# Altium schematic sheet Pixracer_V1_FMU_Alternative_3.SchDoc
size 371 x 257 mm; Origin: Eagle
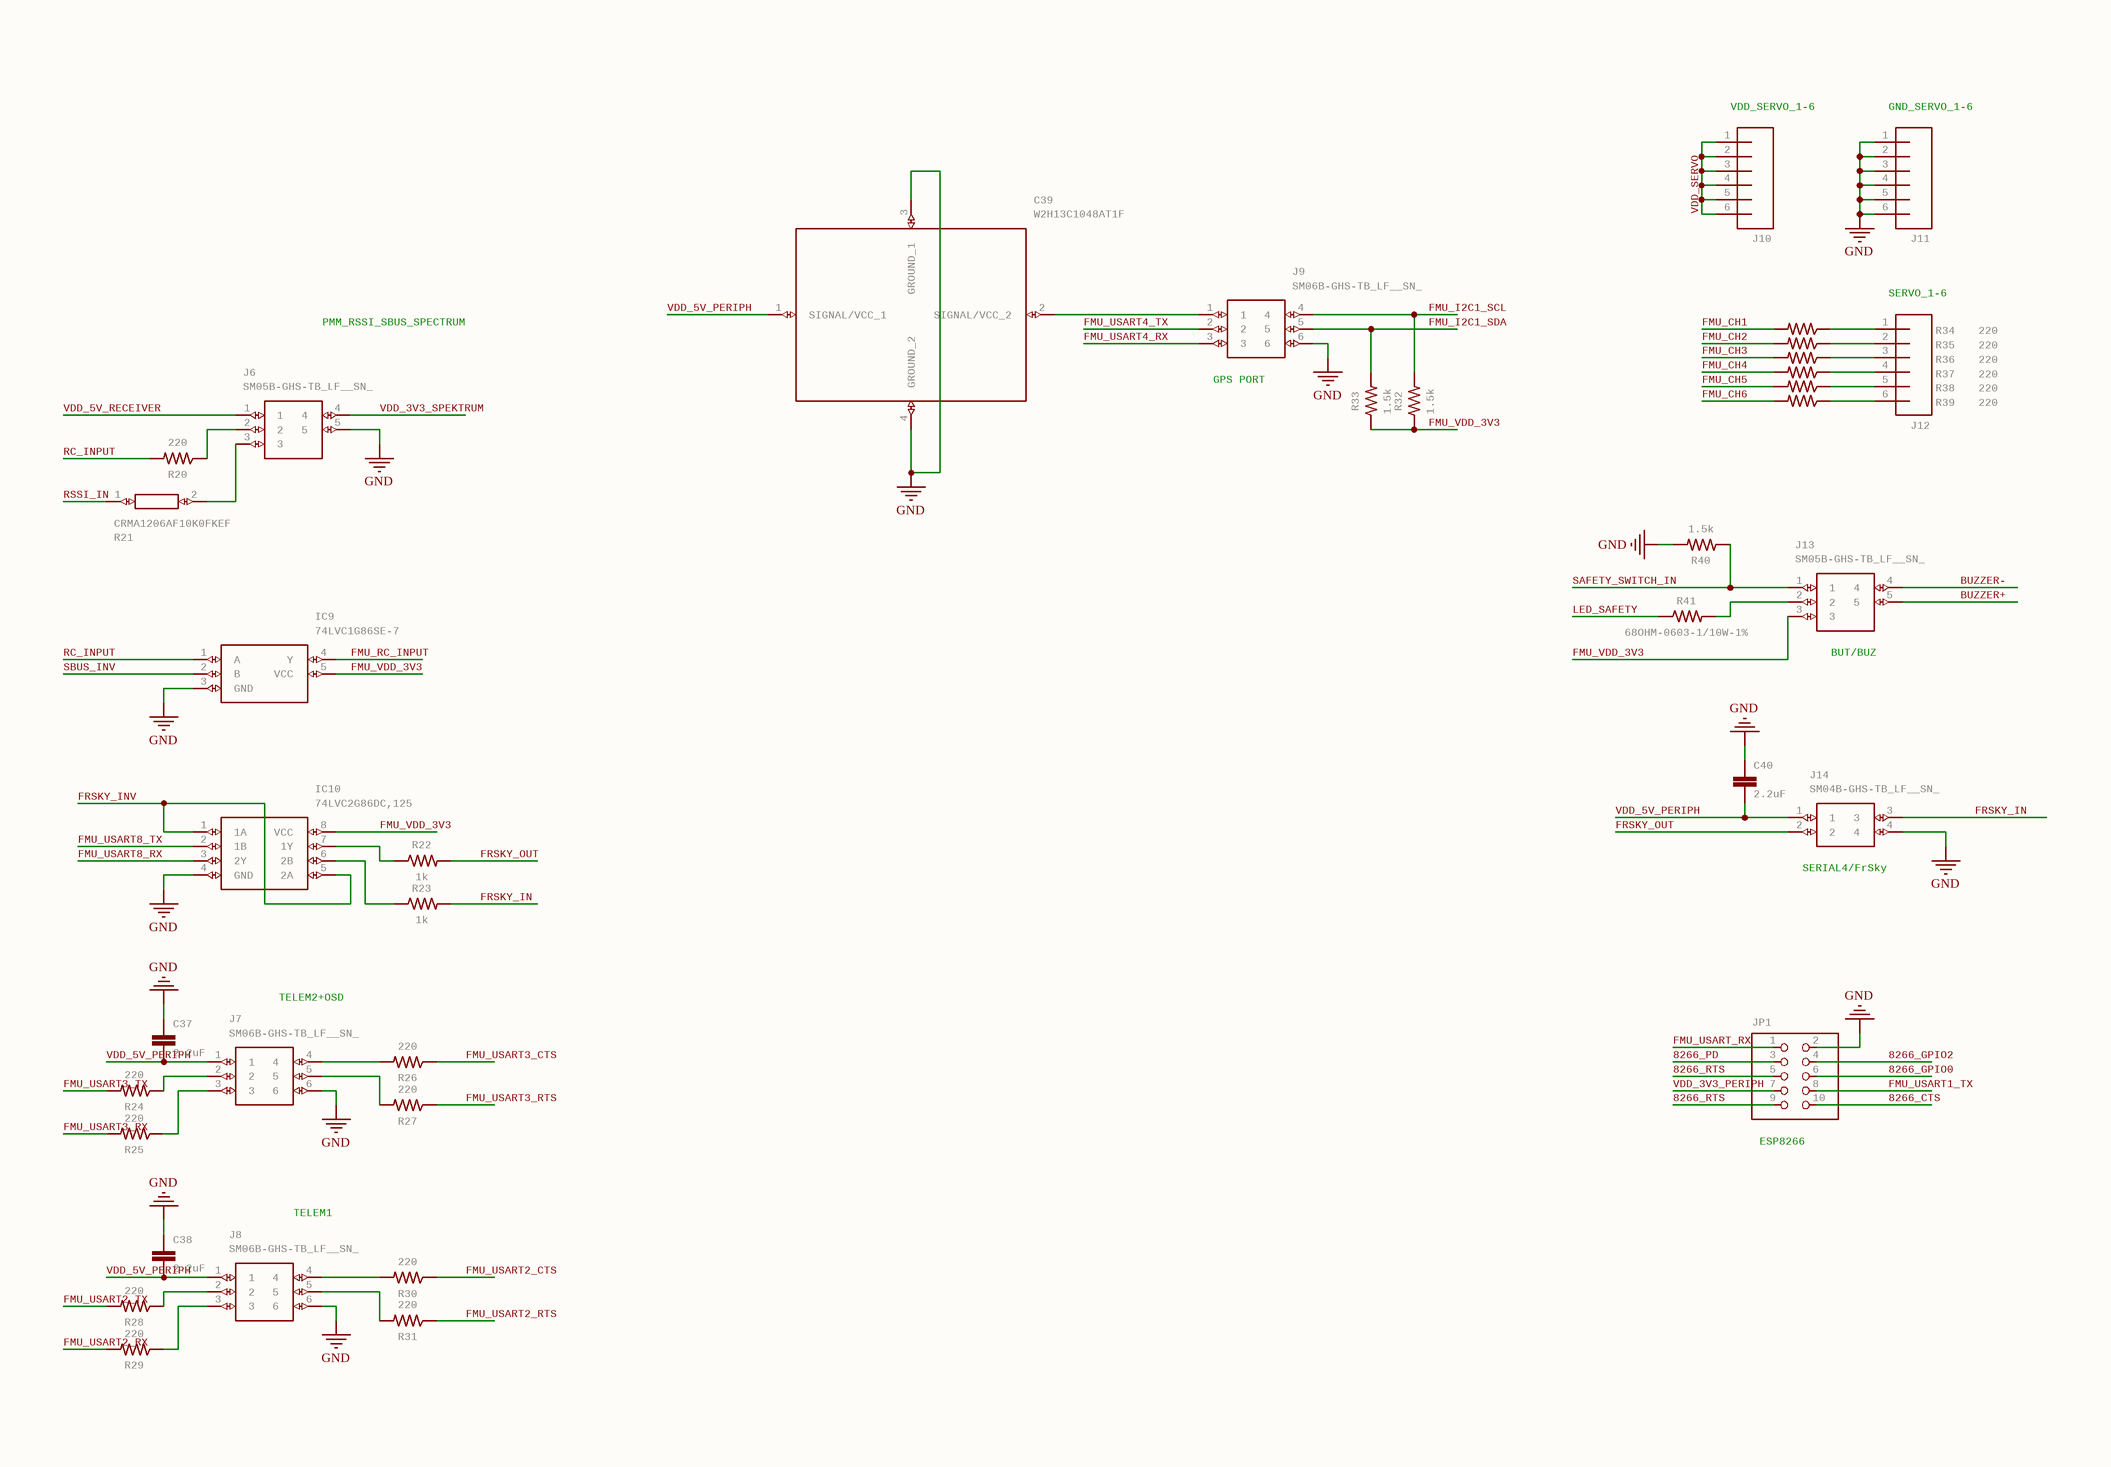
[diagram p0: Pixracer_V1_FMU_Alternative_3.SchDoc]

## Parts
C37  2.2uF  [1206]
C38  2.2uF  [1206]
C39  W2H13C1048AT1F  [W2H13C1048AT1A]
C40  2.2uF  [1206]
IC9  74LVC1G86SE-7  [SOT65P210X110-5N]
IC10  74LVC2G86DC,125  [SOP50P310X100-8N]
J6  SM05B-GHS-TB_LF__SN_  [SM05B-GHS-TB]
J7  SM06B-GHS-TB_LF__SN_  [SM06B-GHS-TB]
J8  SM06B-GHS-TB_LF__SN_  [SM06B-GHS-TB]
J9  SM06B-GHS-TB_LF__SN_  [SM06B-GHS-TB]
J10  CONN_06NO_SILK_NO_POP  [1X06_NO_SILK]  (value not drawn)
J11  CONN_06NO_SILK_NO_POP  [1X06_NO_SILK]  (value not drawn)
J12  CONN_06NO_SILK_NO_POP  [1X06_NO_SILK]  (value not drawn)
J13  SM05B-GHS-TB_LF__SN_  [SM05B-GHS-TB]
J14  SM04B-GHS-TB_LF__SN_  [SM04B-GHS-TB]
JP1  PINHD-2X5  [2X05]  (value not drawn)
R20  220  [0603]
R21  CRMA1206AF10K0FKEF  [RESC3216X74N]
R22  1k  [0603]
R23  1k  [0603]
R24  220  [0603]
R25  220  [0603]
R26  220  [0603]
R27  220  [0603]
R28  220  [0603]
R29  220  [0603]
R30  220  [0603]
R31  220  [0603]
R32  1.5k  [0603]
R33  1.5k  [0603]
R34  220  [0603]
R35  220  [0603]
R36  220  [0603]
R37  220  [0603]
R38  220  [0603]
R39  220  [0603]
R40  1.5k  [0603]
R41  68OHM-0603-1/10W-1%  [0603]

## Nets
GND: C37.1 C38.1 C39.3(GROUND_1) C39.4(GROUND_2) C40.1 IC9.3(GND) IC10.4(GND) J6.5 J7.6 J8.6 J9.6 J11.1 J11.2 J11.3 J11.4 J11.5 J11.6 J14.4 JP1.2 R40.2
8266_CTS: JP1.10
8266_GPIO0: JP1.6
8266_GPIO2: JP1.4
8266_PD: JP1.3
8266_RTS: JP1.5 JP1.9
BUZZER+: J13.5
BUZZER-: J13.4
FMU_CH1: R34.2
FMU_CH2: R35.2
FMU_CH3: R36.2
FMU_CH4: R37.2
FMU_CH5: R38.2
FMU_CH6: R39.2
FMU_I2C1_SCL: J9.4 R32.2
FMU_I2C1_SDA: J9.5 R33.2
FMU_RC_INPUT: IC9.4(Y)
FMU_USART1_TX: JP1.8
FMU_USART2_CTS: R30.1
FMU_USART2_RTS: R31.1
FMU_USART2_RX: R29.2
FMU_USART2_TX: R28.2
FMU_USART3_CTS: R26.1
FMU_USART3_RTS: R27.1
FMU_USART3_RX: R25.2
FMU_USART3_TX: R24.2
FMU_USART4_RX: J9.3
FMU_USART4_TX: J9.2
FMU_USART8_RX: IC10.3(2Y)
FMU_USART8_TX: IC10.2(1B)
FMU_USART_RX: JP1.1
FMU_VDD_3V3: IC9.5(VCC) IC10.8(VCC) J13.3 R32.1 R33.1
FRSKY_IN: J14.3 R23.2
FRSKY_INV: IC10.1(1A) IC10.5(2A)
FRSKY_OUT: J14.2 R22.2
LED_SAFETY: R41.1
RC_INPUT: IC9.1(A) R20.2
RSSI_IN: R21.1
SAFETY_SWITCH_IN: J13.1 R40.1
SBUS_INV: IC9.2(B)
VDD_3V3_PERIPH: JP1.7
VDD_3V3_SPEKTRUM: J6.4
VDD_5V_PERIPH: C37.2 C38.2 C39.1(SIGNAL/VCC_1) C40.2 J7.1 J8.1 J14.1
VDD_5V_RECEIVER: J6.1
VDD_SERVO: J10.1 J10.2 J10.3 J10.4 J10.5 J10.6
NetC39_2: C39.2(SIGNAL/VCC_2) J9.1
NetIC10_6: IC10.6(2B) R23.1
NetIC10_7: IC10.7(1Y) R22.1
NetJ6_2: J6.2 R20.1
NetJ6_3: J6.3 R21.2
NetJ7_2: J7.2 R24.1
NetJ7_3: J7.3 R25.1
NetJ7_4: J7.4 R26.2
NetJ7_5: J7.5 R27.2
NetJ8_2: J8.2 R28.1
NetJ8_3: J8.3 R29.1
NetJ8_4: J8.4 R30.2
NetJ8_5: J8.5 R31.2
NetJ12_1: J12.1 R34.1
NetJ12_2: J12.2 R35.1
NetJ12_3: J12.3 R36.1
NetJ12_4: J12.4 R37.1
NetJ12_5: J12.5 R38.1
NetJ12_6: J12.6 R39.1
NetJ13_2: J13.2 R41.2

## Notes on the sheet
- (near J10) VDD_SERVO_1-6
- (near J11) GND_SERVO_1-6
- PMM_RSSI_SBUS_SPECTRUM
- (near J12) SERVO_1-6
- (near J9) GPS PORT
- (near J13) BUT/BUZ
- (near J14) SERIAL4/FrSky
- TELEM2+OSD
- (near JP1) ESP8266
- TELEM1

## Library data of the parts
C37 C38 C40 = 2.2UF-1206-50V-10%: 2.2ÂµF ceramic capacitors    A capacitor is a passive two-terminal electrical component used to store electrical energy temporarily in an electric field.; GateName_1: G$1; SymbolName_1: CAP; PROD_ID: CAP-10009; DeviceName: -1206-50V-10%; LibraryName: SparkFun-Capacitors; DeviceSetName: 2.2UF
C39 = W2H13C1048AT1F: Feed Through Capacitors 25volt 0.1uF X7R   Source:  Datasheet; MANUFACTURER_NAME: AVX; GateName_1: G$1; SymbolName_1: W2H13C1048AT1F; LibraryName: SamacSys_Parts; DeviceSetName: W2H13C1048AT1F; DESCRIPTION: Feed Through Capacitors 25volt 0.1uF X7R; HEIGHT: 1mm; MANUFACTURER_PART_NUMBER: W2H13C1048AT1F; MOUSER_PART_NUMBER: 581-W2H13C1048AT1F; MOUSER_PRICE-STOCK: https://www.mouser.com/Search/Refine.aspx?Keyword=581-W2H13C1048AT1F
IC9 = 74LVC1G86SE-7: DiodesZetex 74LVC1G86SE-7, XOR 2 Input XOR, 1.65  5.5 V, 5-Pin SOT-353   Source:  Datasheet; MANUFACTURER_NAME: Diodes Inc.; GateName_1: G$1; SymbolName_1: 74LVC1G86SE-7; LibraryName: SamacSys_Parts; DeviceSetName: 74LVC1G86SE-7; DESCRIPTION: DiodesZetex 74LVC1G86SE-7, XOR 2 Input XOR, 1.65  5.5 V, 5-Pin SOT-353; HEIGHT: 1.1mm; MANUFACTURER_PART_NUMBER: 74LVC1G86SE-7; MOUSER_PART_NUMBER: 621-74LVC1G86SE-7; MOUSER_PRICE-STOCK: https://www.mouser.co.uk/ProductDetail/Diodes-Incorporated/74LVC1G86SE-7/?qs=8Dv1RiiPiVJ%252BnYSWg3kTgg%3D%3D
IC10 = 74LVC2G86DC,125: 74LVC2G86 - Dual 2-input EXCLUSIVE-OR gate@en-us   Source:  Datasheet; MANUFACTURER_NAME: Nexperia; GateName_1: G$1; SymbolName_1: 74LVC2G86DC,125; LibraryName: SamacSys_Parts; DeviceSetName: 74LVC2G86DC,125; DESCRIPTION: 74LVC2G86 - Dual 2-input EXCLUSIVE-OR gate; HEIGHT: 1mm; MANUFACTURER_PART_NUMBER: 74LVC2G86DC,125; MOUSER_PART_NUMBER: 771-LVC2G86DC125; MOUSER_PRICE-STOCK: https://www.mouser.co.uk/ProductDetail/Nexperia/74LVC2G86DC125?qs=me8TqzrmIYXbZy3sMRjHUw%3D%3D
J6 J13 = SM05B-GHS-TB_LF__SN_: JST GH Series, 1.25mm Pitch 5 Way Right Angle PCB Header, Solder Termination, 1A   Source:  Datasheet; MANUFACTURER_NAME: JST (JAPAN SOLDERLESS TERMINALS); MANUFACTURER_PART_NUMBER: SM05B-GHS-TB(LF)(SN); GateName_1: G$1; SymbolName_1: SM05B-GHS-TB_LF__SN_; LibraryName: SamacSys_Parts; DeviceSetName: SM05B-GHS-TB_LF__SN_; DESCRIPTION: JST GH Series, 1.25mm Pitch 5 Way Right Angle PCB Header, Solder Termination, 1A; HEIGHT: mm; RS_PART_NUMBER: 7521807P; RS_PRICE-STOCK: http://uk.rs-online.com/web/p/products/7521807P
J7-J9 = SM06B-GHS-TB_LF__SN_: GH 1.25mm header side entry 6 way JST GH Series, 1.25mm Pitch 6 Way Right Angle PCB Header, Solder Termination, 1A   Source:  Datasheet; MANUFACTURER_NAME: JST (JAPAN SOLDERLESS TERMINALS); MANUFACTURER_PART_NUMBER: SM06B-GHS-TB(LF)(SN); GateName_1: G$1; SymbolName_1: SM06B-GHS-TB_LF__SN_; LibraryName: SamacSys_Parts; DeviceSetName: SM06B-GHS-TB_LF__SN_; DESCRIPTION: GH 1.25mm header side entry 6 way JST GH Series, 1.25mm Pitch 6 Way Right Angle PCB Header, Solder Termination, 1A; HEIGHT: mm; RS_PART_NUMBER: 7521800P; RS_PRICE-STOCK: http://uk.rs-online.com/web/p/products/7521800P
J10-J12 = CONN_06NO_SILK_NO_POP: Multi connection point. Often used as Generic Header-pin footprint for 0.1 inch spaced/style header connections    On any of the 0.1 inch spaced packages, you can populate with these:  Break Away Headers - Straight (PRT-00116)   Break Away Male Headers - Right Angle (PRT-00553)   Female Headers (PRT-00115)   Break Away Headers - Machine Pin (PRT-00117)   Break Away Female Headers - Swiss Machine Pin (PRT-00743)   Arduino Stackable Header - 6 Pin (PRT-09280)        For SCREWTERMINALS and SPRING TERMINALS visit here:  Screw Terimnals on SparkFun.com (5mm/3.5mm/2.54mm spacing)       This device is also useful as a general connection point to wire up your design to another part of your project. Our various solder wires solder well into these plated through hole pads.  Hook-Up Wire - Assortment (Stranded, 22 AWG) (PRT-11375)   Hook-Up Wire - Assortment (Solid Core, 22 AWG) (PRT-11367)   View the entire wire category on our website here; GateName_1: G$1; SymbolName_1: CONN_06; DeviceName: NO_SILK_NO_POP; LibraryName: SparkFun-Connectors; DeviceSetName: CONN_06
J14 = SM04B-GHS-TB_LF__SN_: JST GH Series, 1.25mm Pitch 4 Way Right Angle PCB Header, Solder Termination, 1A   Source:  Datasheet; MANUFACTURER_NAME: JST (JAPAN SOLDERLESS TERMINALS); MANUFACTURER_PART_NUMBER: SM04B-GHS-TB(LF)(SN); GateName_1: G$1; SymbolName_1: SM04B-GHS-TB_LF__SN_; LibraryName: SamacSys_Parts; DeviceSetName: SM04B-GHS-TB_LF__SN_; DESCRIPTION: JST GH Series, 1.25mm Pitch 4 Way Right Angle PCB Header, Solder Termination, 1A; HEIGHT: mm; RS_PART_NUMBER: 7521797P; RS_PRICE-STOCK: http://uk.rs-online.com/web/p/products/7521797P
JP1 = PINHD-2X5: PIN HEADER; GateName_1: A; SymbolName_1: PINH2X5; POPULARITY: 35; LibraryName: pinhead; DeviceSetName: PINHD-2X5
R20 R24-R31 R34-R39 = 220OHM-0603-1/10W-1%: 220Î© resistor    A resistor is a passive two-terminal electrical component that implements electrical resistance as a circuit element. Resistors act to reduce current flow, and, at the same time, act to lower voltage levels within circuits. - Wikipedia; GateName_1: G$1; DeviceSetName: 220OHM; PROD_ID: RES-07861; SymbolName_1: RESISTOR; DeviceName: -0603-1/10W-1%; LibraryName: SparkFun-Resistors
R21 = CRMA1206AF10K0FKEF: Thick Film Resistors - SMD 0.30W 10Kohm 1% AEC-Q200   Source:  Datasheet; MANUFACTURER_NAME: Vishay; GateName_1: G$1; SymbolName_1: CRMA1206AF10K0FKEF; LibraryName: SamacSys_Parts; DeviceSetName: CRMA1206AF10K0FKEF; DESCRIPTION: Thick Film Resistors - SMD 0.30W 10Kohm 1% AEC-Q200; HEIGHT: 0.74mm; MANUFACTURER_PART_NUMBER: CRMA1206AF10K0FKEF; MOUSER_PART_NUMBER: 71-CRMA1206AF10K0FKF; MOUSER_PRICE-STOCK: https://www.mouser.co.uk/ProductDetail/Vishay/CRMA1206AF10K0FKEF?qs=TiOZkKH1s2Q81nOs5FD1Wg%3D%3D
R22 R23 = 1KOHM-0603-1/10W-1%: 1kÎ© resistor    A resistor is a passive two-terminal electrical component that implements electrical resistance as a circuit element. Resistors act to reduce current flow, and, at the same time, act to lower voltage levels within circuits. - Wikipedia; GateName_1: G$1; DeviceSetName: 1KOHM; PROD_ID: RES-07856; SymbolName_1: RESISTOR; DeviceName: -0603-1/10W-1%; LibraryName: SparkFun-Resistors
R32 R33 R40 = 1.5KOHM-0603-1/10W-1%: 1.5kÎ© resistor    A resistor is a passive two-terminal electrical component that implements electrical resistance as a circuit element. Resistors act to reduce current flow, and, at the same time, act to lower voltage levels within circuits. - Wikipedia; GateName_1: G$1; PROD_ID: RES-08306; SymbolName_1: RESISTOR; DeviceName: -0603-1/10W-1%; LibraryName: SparkFun-Resistors; DeviceSetName: 1.5KOHM
R41 = 68OHM-0603-1/10W-1%: 68Î© resistor    A resistor is a passive two-terminal electrical component that implements electrical resistance as a circuit element. Resistors act to reduce current flow, and, at the same time, act to lower voltage levels within circuits. - Wikipedia; GateName_1: G$1; DeviceSetName: 68OHM; SymbolName_1: RESISTOR; DeviceName: -0603-1/10W-1%; LibraryName: SparkFun-Resistors